# Altium project Relay_Machine_PCB.PrjPcb
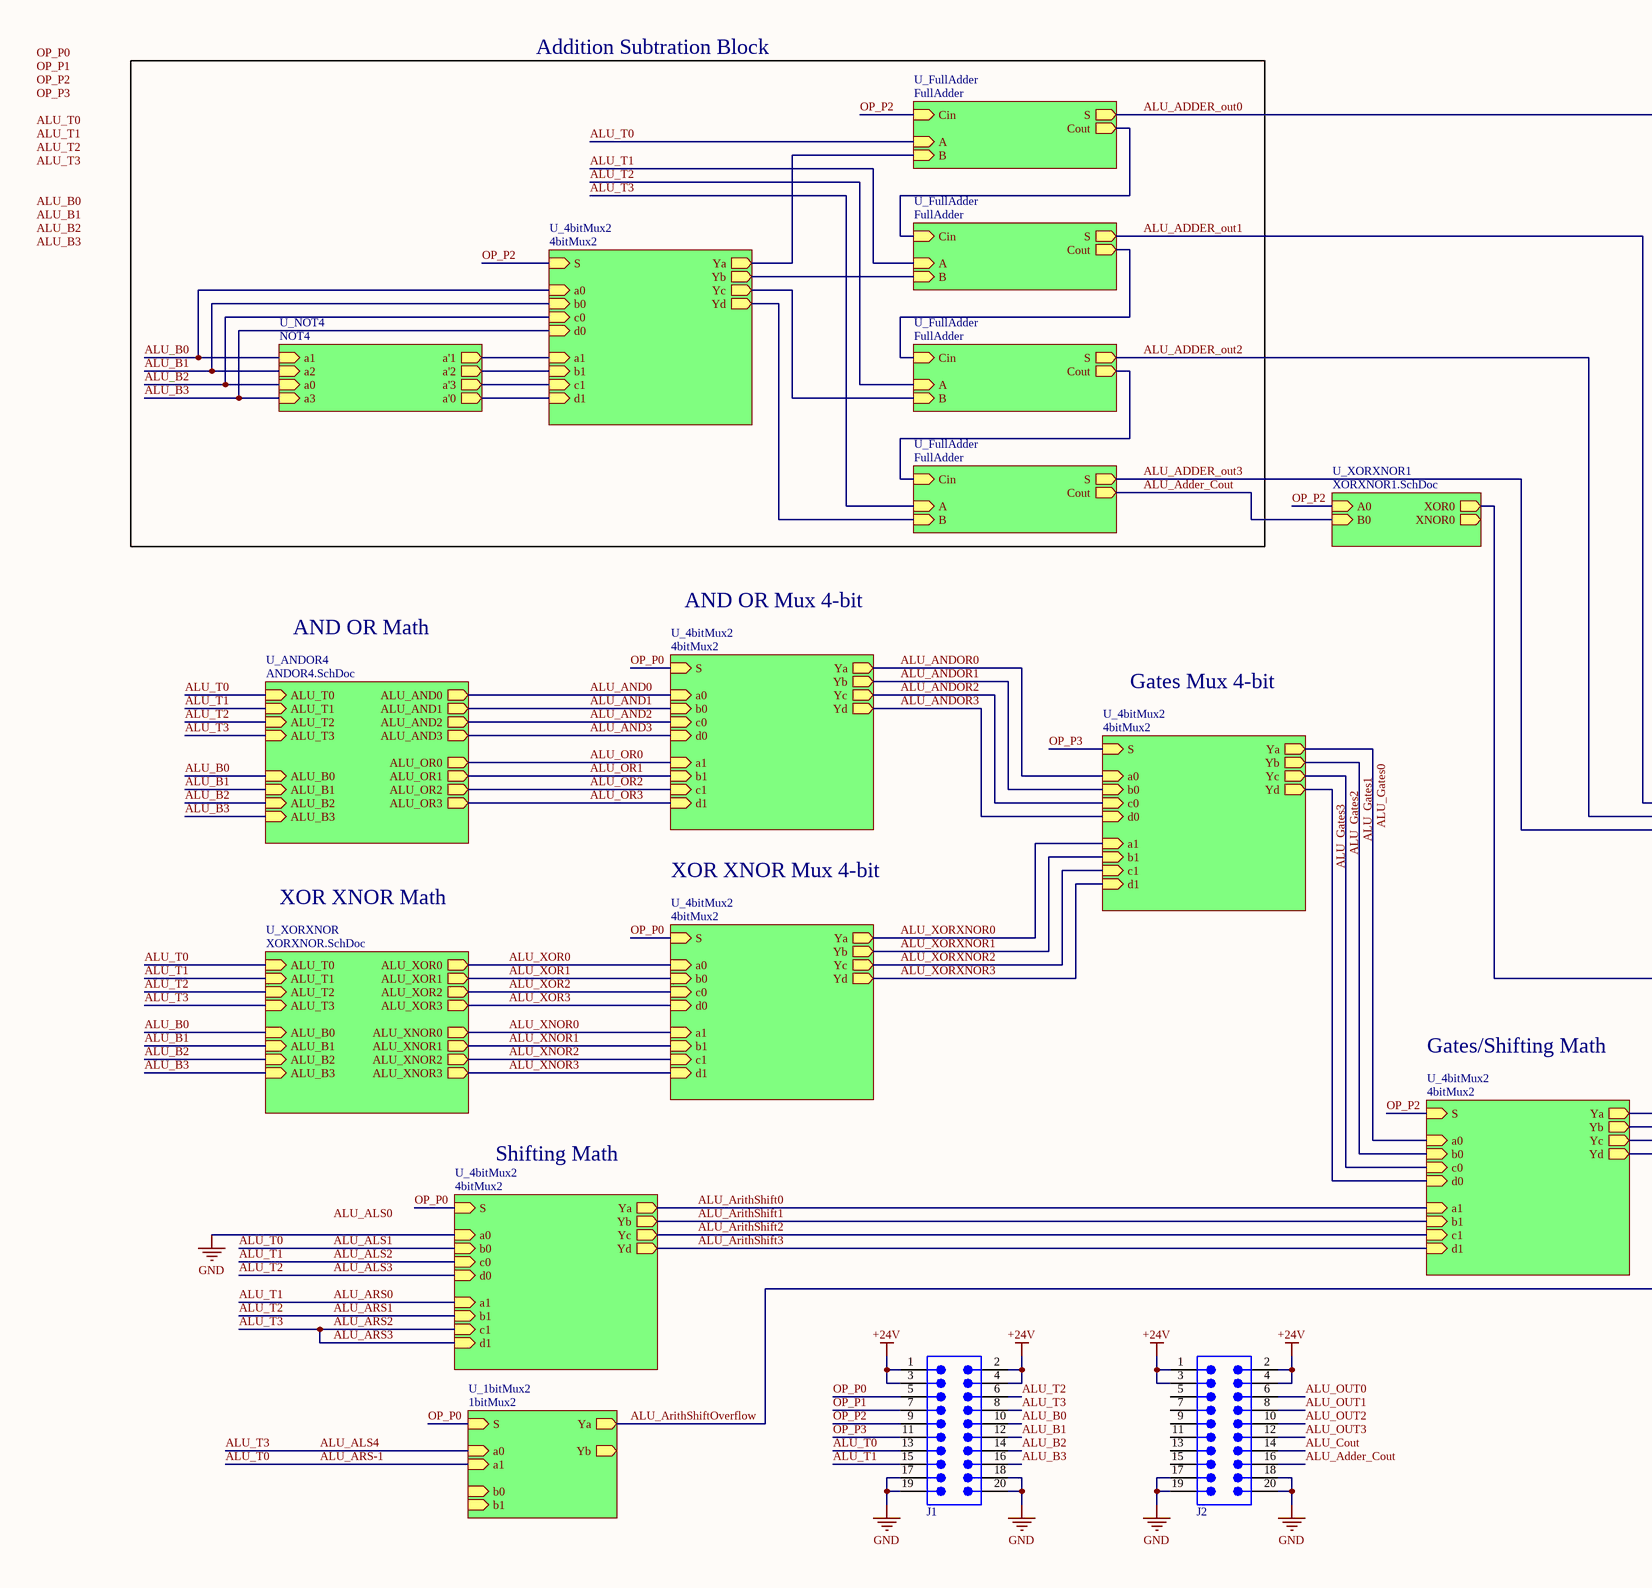
[diagram p0: ALU.SchDoc, left]
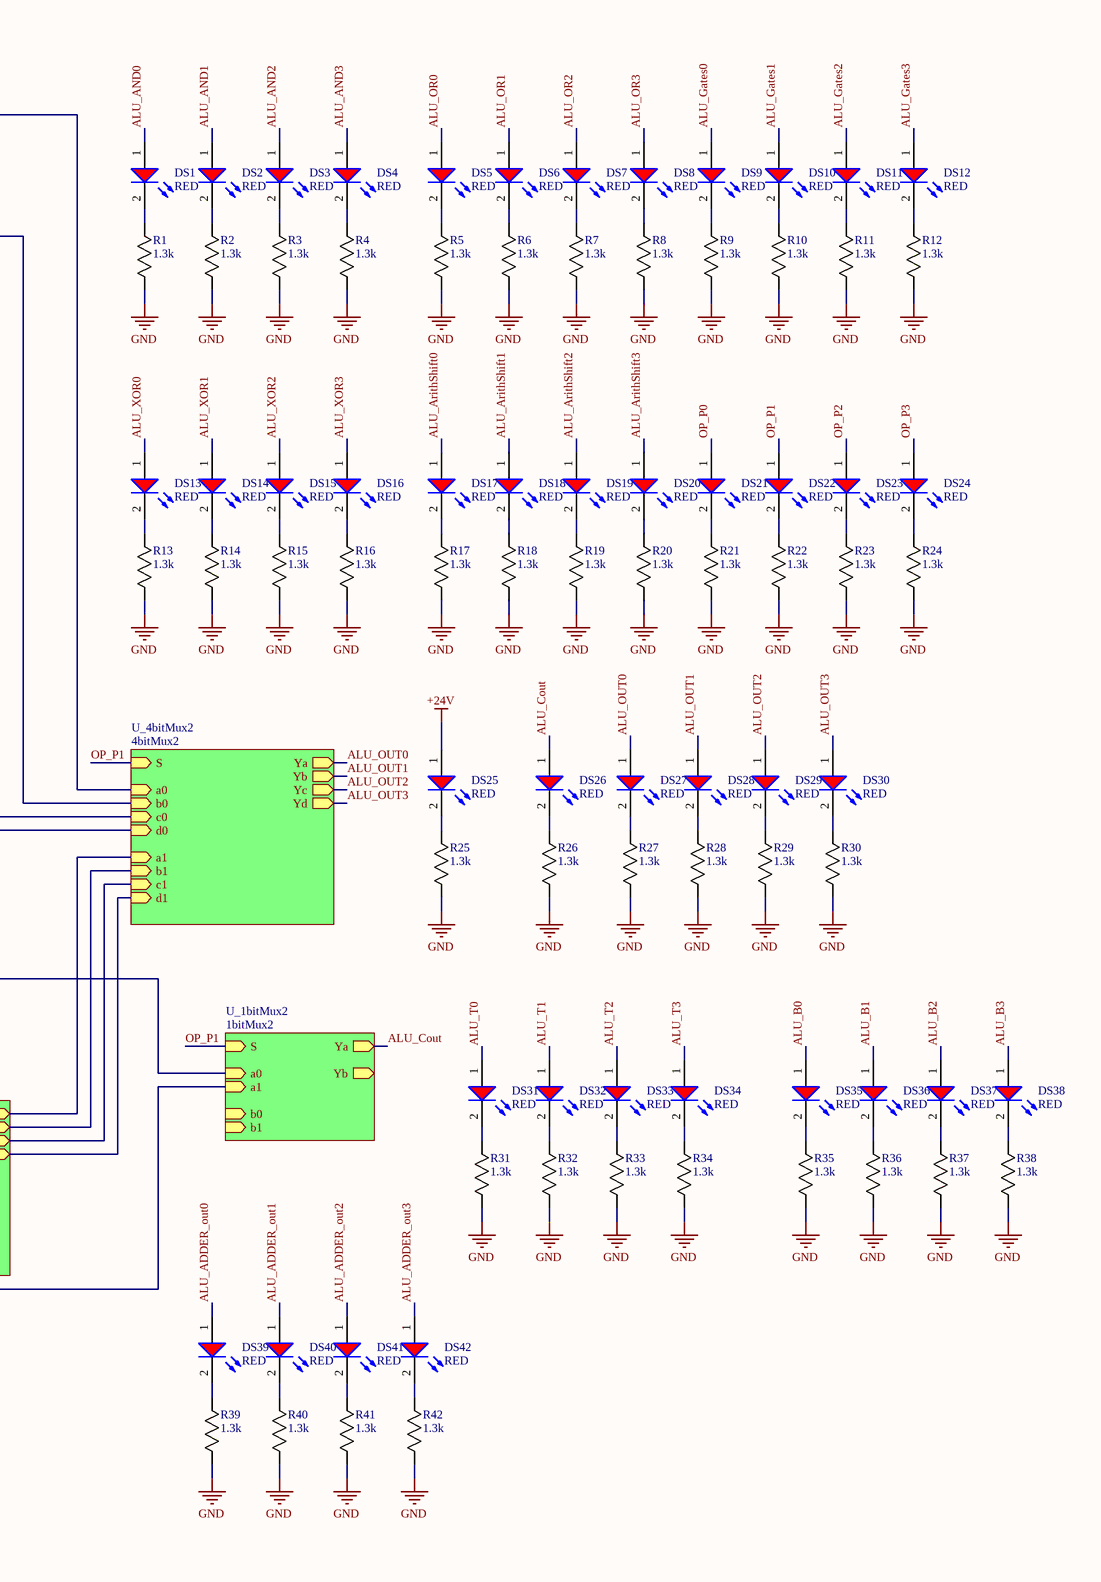
[diagram p1: ALU.SchDoc, right]
4 sheets, 109 parts. Net scope: hierarchical (ports join the sheet entries above them; power ports are global).
Board file: PCB_ALU.PcbDoc
Sheets:
  ALU.SchDoc
    U_ANDOR4 = ANDOR4.SchDoc
    U_XORXNOR = XORXNOR.SchDoc
    U_XORXNOR1 = XORXNOR1.SchDoc

## Sheet ALU.SchDoc
size 533 x 304 mm; SheetNumber: 1; SheetTotal: 8

### Parts
DS1  RED  [LED RED 151051RS11000]
DS2  RED  [LED RED 151051RS11000]
DS3  RED  [LED RED 151051RS11000]
DS4  RED  [LED RED 151051RS11000]
DS5  RED  [LED RED 151051RS11000]
DS6  RED  [LED RED 151051RS11000]
DS7  RED  [LED RED 151051RS11000]
DS8  RED  [LED RED 151051RS11000]
DS9  RED  [LED RED 151051RS11000]
DS10  RED  [LED RED 151051RS11000]
DS11  RED  [LED RED 151051RS11000]
DS12  RED  [LED RED 151051RS11000]
DS13  RED  [LED RED 151051RS11000]
DS14  RED  [LED RED 151051RS11000]
DS15  RED  [LED RED 151051RS11000]
DS16  RED  [LED RED 151051RS11000]
DS17  RED  [LED RED 151051RS11000]
DS18  RED  [LED RED 151051RS11000]
DS19  RED  [LED RED 151051RS11000]
DS20  RED  [LED RED 151051RS11000]
DS21  RED  [LED RED 151051RS11000]
DS22  RED  [LED RED 151051RS11000]
DS23  RED  [LED RED 151051RS11000]
DS24  RED  [LED RED 151051RS11000]
DS25  RED  [LED RED 151051RS11000]
DS26  RED  [LED RED 151051RS11000]
DS27  RED  [LED RED 151051RS11000]
DS28  RED  [LED RED 151051RS11000]
DS29  RED  [LED RED 151051RS11000]
DS30  RED  [LED RED 151051RS11000]
DS31  RED  [LED RED 151051RS11000]
DS32  RED  [LED RED 151051RS11000]
DS33  RED  [LED RED 151051RS11000]
DS34  RED  [LED RED 151051RS11000]
DS35  RED  [LED RED 151051RS11000]
DS36  RED  [LED RED 151051RS11000]
DS37  RED  [LED RED 151051RS11000]
DS38  RED  [LED RED 151051RS11000]
DS39  RED  [LED RED 151051RS11000]
DS40  RED  [LED RED 151051RS11000]
DS41  RED  [LED RED 151051RS11000]
DS42  RED  [LED RED 151051RS11000]
J1  Con 61202021621  [Con 61202021621]  (value not drawn)
J2  Con 61202021621  [Con 61202021621]  (value not drawn)
R1  1.3k  [RES 2512]
R2  1.3k  [RES 2512]
R3  1.3k  [RES 2512]
R4  1.3k  [RES 2512]
R5  1.3k  [RES 2512]
R6  1.3k  [RES 2512]
R7  1.3k  [RES 2512]
R8  1.3k  [RES 2512]
R9  1.3k  [RES 2512]
R10  1.3k  [RES 2512]
R11  1.3k  [RES 2512]
R12  1.3k  [RES 2512]
R13  1.3k  [RES 2512]
R14  1.3k  [RES 2512]
R15  1.3k  [RES 2512]
R16  1.3k  [RES 2512]
R17  1.3k  [RES 2512]
R18  1.3k  [RES 2512]
R19  1.3k  [RES 2512]
R20  1.3k  [RES 2512]
R21  1.3k  [RES 2512]
R22  1.3k  [RES 2512]
R23  1.3k  [RES 2512]
R24  1.3k  [RES 2512]
R25  1.3k  [RES 2512]
R26  1.3k  [RES 2512]
R27  1.3k  [RES 2512]
R28  1.3k  [RES 2512]
R29  1.3k  [RES 2512]
R30  1.3k  [RES 2512]
R31  1.3k  [RES 2512]
R32  1.3k  [RES 2512]
R33  1.3k  [RES 2512]
R34  1.3k  [RES 2512]
R35  1.3k  [RES 2512]
R36  1.3k  [RES 2512]
R37  1.3k  [RES 2512]
R38  1.3k  [RES 2512]
R39  1.3k  [RES 2512]
R40  1.3k  [RES 2512]
R41  1.3k  [RES 2512]
R42  1.3k  [RES 2512]

### Sub-sheets
U_1bitMux2 = 1bitMux2 (file not in this document): S (in), a0 (in), b0 (in), a1 (in), b1 (in), Ya (out), Yb (out)
U_1bitMux2 = 1bitMux2 (file not in this document): S (in), a0 (in), b0 (in), a1 (in), b1 (in), Ya (out), Yb (out)
U_4bitMux2 = 4bitMux2 (file not in this document): S (in), a0 (in), b0 (in), c0 (in), d0 (in), a1 (in), b1 (in), c1 (in), d1 (in), Ya (out), Yb (out), Yc (out), Yd (out)
U_4bitMux2 = 4bitMux2 (file not in this document): S (in), a0 (in), b0 (in), c0 (in), d0 (in), a1 (in), b1 (in), c1 (in), d1 (in), Ya (out), Yb (out), Yc (out), Yd (out)
U_4bitMux2 = 4bitMux2 (file not in this document): S (in), a0 (in), b0 (in), c0 (in), d0 (in), a1 (in), b1 (in), c1 (in), d1 (in), Ya (out), Yb (out), Yc (out), Yd (out)
U_4bitMux2 = 4bitMux2 (file not in this document): S (in), a0 (in), b0 (in), c0 (in), d0 (in), a1 (in), b1 (in), c1 (in), d1 (in), Ya (out), Yb (out), Yc (out), Yd (out)
U_4bitMux2 = 4bitMux2 (file not in this document): S (in), a0 (in), b0 (in), c0 (in), d0 (in), a1 (in), b1 (in), c1 (in), d1 (in), Ya (out), Yb (out), Yc (out), Yd (out)
U_4bitMux2 = 4bitMux2 (file not in this document): S (in), a0 (in), b0 (in), c0 (in), d0 (in), a1 (in), b1 (in), c1 (in), d1 (in), Ya (out), Yb (out), Yc (out), Yd (out)
U_4bitMux2 = 4bitMux2 (file not in this document): S (in), a0 (in), b0 (in), c0 (in), d0 (in), a1 (in), b1 (in), c1 (in), d1 (in), Ya (out), Yb (out), Yc (out), Yd (out)
U_ANDOR4 = ANDOR4.SchDoc: ALU_AND0 (out), ALU_T0 (in), ALU_B0 (in), ALU_OR0 (out), ALU_AND1 (out), ALU_T1 (in), ALU_B1 (in), ALU_OR1 (out), ALU_AND2 (out), ALU_T2 (in), ALU_B2 (in), ALU_OR2 (out), ALU_AND3 (out), ALU_T3 (in), ALU_B3 (in), ALU_OR3 (out)
U_FullAdder = FullAdder (file not in this document): A (in), B (in), Cin (in), S (out), Cout (out)
U_FullAdder = FullAdder (file not in this document): A (in), B (in), Cin (in), S (out), Cout (out)
U_FullAdder = FullAdder (file not in this document): A (in), B (in), Cin (in), S (out), Cout (out)
U_FullAdder = FullAdder (file not in this document): A (in), B (in), Cin (in), S (out), Cout (out)
U_NOT4 = NOT4 (file not in this document): a1 (in), a2 (in), a'1 (out), a'2 (out), a'3 (out), a'0 (out), a0 (in), a3 (in)
U_XORXNOR = XORXNOR.SchDoc: ALU_T0 (in), ALU_B0 (in), ALU_B1 (in), ALU_B2 (in), ALU_B3 (in), ALU_T1 (in), ALU_T2 (in), ALU_T3 (in), ALU_XOR0 (out), ALU_XNOR1 (out), ALU_XNOR3 (out), ALU_XOR1 (out), ALU_XOR3 (out), ALU_XNOR0 (out), ALU_XOR2 (out), ALU_XNOR2 (out)
U_XORXNOR1 = XORXNOR1.SchDoc: B0 (in), A0 (in), XOR0 (out), XNOR0 (out)

### Nets
+24V: DS25.1(A) J1.1 J1.2 J1.3 J1.4 J2.1 J2.2 J2.3 J2.4
GND: J1.17 J1.18 J1.19 J1.20 J2.17 J2.18 J2.19 J2.20 R1.2 R2.2 R3.2 R4.2 R5.2 R6.2 R7.2 R8.2 R9.2 R10.2 R11.2 R12.2 R13.2 R14.2 R15.2 R16.2 R17.2 R18.2 R19.2 R20.2 R21.2 R22.2 R23.2 R24.2 R25.2 R26.2 R27.2 R28.2 R29.2 R30.2 R31.2 R32.2 R33.2 R34.2 R35.2 R36.2 R37.2 R38.2 R39.2 R40.2 R41.2 R42.2 ; sheet U_4bitMux2/a0
ALU_Adder_Cout: J2.16 ; sheet U_FullAdder/Cout, sheet U_XORXNOR1/B0
ALU_ADDER_out0: DS39.1(A) ; sheet U_FullAdder/S, sheet U_4bitMux2/a0
ALU_ADDER_out1: DS40.1(A) ; sheet U_FullAdder/S, sheet U_4bitMux2/b0
ALU_ADDER_out2: DS41.1(A) ; sheet U_FullAdder/S, sheet U_4bitMux2/c0
ALU_ADDER_out3: DS42.1(A) ; sheet U_FullAdder/S, sheet U_4bitMux2/d0
ALU_ALS1: DS31.1(A) J1.13 ; sheet U_ANDOR4/ALU_T0, sheet U_FullAdder/A, sheet U_XORXNOR/ALU_T0, sheet U_1bitMux2/a1, sheet U_4bitMux2/b0  [also labelled ALU_ARS-1, ALU_T0]
ALU_ALS2: DS32.1(A) J1.15 ; sheet U_ANDOR4/ALU_T1, sheet U_FullAdder/A, sheet U_XORXNOR/ALU_T1, sheet U_4bitMux2/c0, sheet U_4bitMux2/a1  [also labelled ALU_ARS0, ALU_T1]
ALU_ALS3: DS33.1(A) J1.6 ; sheet U_ANDOR4/ALU_T2, sheet U_FullAdder/A, sheet U_XORXNOR/ALU_T2, sheet U_4bitMux2/d0, sheet U_4bitMux2/b1  [also labelled ALU_ARS1, ALU_T2]
ALU_ALS4: DS34.1(A) J1.8 ; sheet U_ANDOR4/ALU_T3, sheet U_FullAdder/A, sheet U_XORXNOR/ALU_T3, sheet U_1bitMux2/a0, sheet U_4bitMux2/c1, sheet U_4bitMux2/d1  [also labelled ALU_ARS2, ALU_ARS3, ALU_T3]
ALU_AND0: DS1.1(A) ; sheet U_ANDOR4/ALU_AND0, sheet U_4bitMux2/a0
ALU_AND1: DS2.1(A) ; sheet U_ANDOR4/ALU_AND1, sheet U_4bitMux2/b0
ALU_AND2: DS3.1(A) ; sheet U_ANDOR4/ALU_AND2, sheet U_4bitMux2/c0
ALU_AND3: DS4.1(A) ; sheet U_ANDOR4/ALU_AND3, sheet U_4bitMux2/d0
ALU_ANDOR0: sheet U_4bitMux2/Ya, sheet U_4bitMux2/a0
ALU_ANDOR1: sheet U_4bitMux2/Yb, sheet U_4bitMux2/b0
ALU_ANDOR2: sheet U_4bitMux2/Yc, sheet U_4bitMux2/c0
ALU_ANDOR3: sheet U_4bitMux2/Yd, sheet U_4bitMux2/d0
ALU_ArithShift0: DS17.1(A) ; sheet U_4bitMux2/Ya, sheet U_4bitMux2/a1
ALU_ArithShift1: DS18.1(A) ; sheet U_4bitMux2/Yb, sheet U_4bitMux2/b1
ALU_ArithShift2: DS19.1(A) ; sheet U_4bitMux2/Yc, sheet U_4bitMux2/c1
ALU_ArithShift3: DS20.1(A) ; sheet U_4bitMux2/Yd, sheet U_4bitMux2/d1
ALU_ArithShiftOverflow: sheet U_1bitMux2/Ya, sheet U_1bitMux2/a1
ALU_B0: DS35.1(A) J1.10 ; sheet U_ANDOR4/ALU_B0, sheet U_NOT4/a1, sheet U_4bitMux2/a0, sheet U_XORXNOR/ALU_B0
ALU_B1: DS36.1(A) J1.12 ; sheet U_ANDOR4/ALU_B1, sheet U_NOT4/a2, sheet U_4bitMux2/b0, sheet U_XORXNOR/ALU_B1
ALU_B2: DS37.1(A) J1.14 ; sheet U_ANDOR4/ALU_B2, sheet U_NOT4/a0, sheet U_4bitMux2/c0, sheet U_XORXNOR/ALU_B2
ALU_B3: DS38.1(A) J1.16 ; sheet U_ANDOR4/ALU_B3, sheet U_NOT4/a3, sheet U_4bitMux2/d0, sheet U_XORXNOR/ALU_B3
ALU_Cout: DS26.1(A) J2.14 ; sheet U_1bitMux2/Ya
ALU_Gates0: DS9.1(A) ; sheet U_4bitMux2/Ya, sheet U_4bitMux2/a0
ALU_Gates1: DS10.1(A) ; sheet U_4bitMux2/Yb, sheet U_4bitMux2/b0
ALU_Gates2: DS11.1(A) ; sheet U_4bitMux2/Yc, sheet U_4bitMux2/c0
ALU_Gates3: DS12.1(A) ; sheet U_4bitMux2/Yd, sheet U_4bitMux2/d0
ALU_OR0: DS5.1(A) ; sheet U_ANDOR4/ALU_OR0, sheet U_4bitMux2/a1
ALU_OR1: DS6.1(A) ; sheet U_ANDOR4/ALU_OR1, sheet U_4bitMux2/b1
ALU_OR2: DS7.1(A) ; sheet U_ANDOR4/ALU_OR2, sheet U_4bitMux2/c1
ALU_OR3: DS8.1(A) ; sheet U_ANDOR4/ALU_OR3, sheet U_4bitMux2/d1
ALU_OUT0: DS27.1(A) J2.6 ; sheet U_4bitMux2/Ya
ALU_OUT1: DS28.1(A) J2.8 ; sheet U_4bitMux2/Yb
ALU_OUT2: DS29.1(A) J2.10 ; sheet U_4bitMux2/Yc
ALU_OUT3: DS30.1(A) J2.12 ; sheet U_4bitMux2/Yd
ALU_XNOR0: sheet U_XORXNOR/ALU_XNOR0, sheet U_4bitMux2/a1
ALU_XNOR1: sheet U_XORXNOR/ALU_XNOR1, sheet U_4bitMux2/b1
ALU_XNOR2: sheet U_XORXNOR/ALU_XNOR2, sheet U_4bitMux2/c1
ALU_XNOR3: sheet U_XORXNOR/ALU_XNOR3, sheet U_4bitMux2/d1
ALU_XOR0: DS13.1(A) ; sheet U_XORXNOR/ALU_XOR0, sheet U_4bitMux2/a0
ALU_XOR1: DS14.1(A) ; sheet U_XORXNOR/ALU_XOR1, sheet U_4bitMux2/b0
ALU_XOR2: DS15.1(A) ; sheet U_XORXNOR/ALU_XOR2, sheet U_4bitMux2/c0
ALU_XOR3: DS16.1(A) ; sheet U_XORXNOR/ALU_XOR3, sheet U_4bitMux2/d0
ALU_XORXNOR0: sheet U_4bitMux2/a1, sheet U_4bitMux2/Ya
ALU_XORXNOR1: sheet U_4bitMux2/b1, sheet U_4bitMux2/Yb
ALU_XORXNOR2: sheet U_4bitMux2/c1, sheet U_4bitMux2/Yc
ALU_XORXNOR3: sheet U_4bitMux2/d1, sheet U_4bitMux2/Yd
OP_P0: DS21.1(A) J1.5 ; sheet U_4bitMux2/S, sheet U_4bitMux2/S, sheet U_1bitMux2/S, sheet U_4bitMux2/S
OP_P1: DS22.1(A) J1.7 ; sheet U_4bitMux2/S, sheet U_1bitMux2/S
OP_P2: DS23.1(A) J1.9 ; sheet U_FullAdder/Cin, sheet U_4bitMux2/S, sheet U_4bitMux2/S, sheet U_XORXNOR1/A0
OP_P3: DS24.1(A) J1.11 ; sheet U_4bitMux2/S
NetDS1_2: DS1.2(K) R1.1
NetDS2_2: DS2.2(K) R2.1
NetDS3_2: DS3.2(K) R3.1
NetDS4_2: DS4.2(K) R4.1
NetDS5_2: DS5.2(K) R5.1
NetDS6_2: DS6.2(K) R6.1
NetDS7_2: DS7.2(K) R7.1
NetDS8_2: DS8.2(K) R8.1
NetDS9_2: DS9.2(K) R9.1
NetDS10_2: DS10.2(K) R10.1
NetDS11_2: DS11.2(K) R11.1
NetDS12_2: DS12.2(K) R12.1
NetDS13_2: DS13.2(K) R13.1
NetDS14_2: DS14.2(K) R14.1
NetDS15_2: DS15.2(K) R15.1
NetDS16_2: DS16.2(K) R16.1
NetDS17_2: DS17.2(K) R17.1
NetDS18_2: DS18.2(K) R18.1
NetDS19_2: DS19.2(K) R19.1
NetDS20_2: DS20.2(K) R20.1
NetDS21_2: DS21.2(K) R21.1
NetDS22_2: DS22.2(K) R22.1
NetDS23_2: DS23.2(K) R23.1
NetDS24_2: DS24.2(K) R24.1
NetDS25_2: DS25.2(K) R25.1
NetDS26_2: DS26.2(K) R26.1
NetDS27_2: DS27.2(K) R27.1
NetDS28_2: DS28.2(K) R28.1
NetDS29_2: DS29.2(K) R29.1
NetDS30_2: DS30.2(K) R30.1
NetDS31_2: DS31.2(K) R31.1
NetDS32_2: DS32.2(K) R32.1
NetDS33_2: DS33.2(K) R33.1
NetDS34_2: DS34.2(K) R34.1
NetDS35_2: DS35.2(K) R35.1
NetDS36_2: DS36.2(K) R36.1
NetDS37_2: DS37.2(K) R37.1
NetDS38_2: DS38.2(K) R38.1
NetDS39_2: DS39.2(K) R39.1
NetDS40_2: DS40.2(K) R40.1
NetDS41_2: DS41.2(K) R41.1
NetDS42_2: DS42.2(K) R42.1
NetK9_2: sheet U_1bitMux2/a0, sheet U_XORXNOR1/XOR0
(unnamed): sheet U_FullAdder/B, sheet U_4bitMux2/Ya
(unnamed): sheet U_FullAdder/Cout, sheet U_FullAdder/Cin
(unnamed): sheet U_FullAdder/B, sheet U_4bitMux2/Yb
(unnamed): sheet U_FullAdder/Cout, sheet U_FullAdder/Cin
(unnamed): sheet U_FullAdder/B, sheet U_4bitMux2/Yc
(unnamed): sheet U_FullAdder/Cout, sheet U_FullAdder/Cin
(unnamed): sheet U_FullAdder/B, sheet U_4bitMux2/Yd
(unnamed): sheet U_NOT4/a'1, sheet U_4bitMux2/a1
(unnamed): sheet U_NOT4/a'2, sheet U_4bitMux2/b1
(unnamed): sheet U_NOT4/a'3, sheet U_4bitMux2/c1
(unnamed): sheet U_NOT4/a'0, sheet U_4bitMux2/d1
(unnamed): sheet U_4bitMux2/Ya, sheet U_4bitMux2/a1
(unnamed): sheet U_4bitMux2/Yb, sheet U_4bitMux2/b1
(unnamed): sheet U_4bitMux2/Yc, sheet U_4bitMux2/c1
(unnamed): sheet U_4bitMux2/Yd, sheet U_4bitMux2/d1

Not connected (* = marked no-connect by the designer): J2 5 7 9 11 13 15

### Notes on the sheet
- Addition Subtration Block
- AND OR Mux 4-bit
- AND OR Math
- Gates Mux 4-bit
- XOR XNOR Mux 4-bit
- XOR XNOR Math
- Gates/Shifting Math
- Shifting Math
- Labels drawn without touching a wire or pin: ALU_ALS0, ALU_B0, ALU_B1, ALU_B2, ALU_B3, ALU_T0, ALU_T1, ALU_T2, ALU_T3, OP_P0, OP_P1, OP_P2, OP_P3

### Library data of the parts
DS1-DS42 = LED RED 151051RS11000: WL-TMRC Red Color Diffused 5 mm Round Through Hole LED; Manufacturer: Wurth Elektronik; Dominant Wavelength: 645nm; Forward Current: 100mA; Forward Voltage: 2.1V; Lens Size: 5mm; Lens Style: Circular, Diffused, Round; Luminous Intensity: 30mcd; Max Reverse Voltage (DC): 5V; Peak Wavelength: 650nm; Test Current: 20mA; Viewing Angle: 60°; Wavelength: 630nm; Supplier: DigiKey; Supplier Part Number: 732-5016-ND; Manufacturer Part Number: 151051RS11000; RoHS: Compliant; Category: LEDs; Stock: 19120; Pricing: 1=0.15, 50=0.1396, 100=0.1197, 500=0.105 (USD); Case/Package: Radial; Color: Red; Height: 8.6mm; Length: 5mm; Max Operating Temperature: 85°C; Min Operating Temperature: -40°C; Mounting Technology: Through Hole; Packaging: Bulk; REACH SVHC: Unknown; Width: 5mm; ComponentLink1URL: https://datasheet.octopart.com:443/151051RS11000-Wurth-Elektronik-datasheet-168474692.pdf?src-supplier=Wurth+Elektronik; ComponentLink1Description: https://datasheet.octopart.com:443/151051RS11000-Wurth-Elektronik-datasheet-168474692.pdf?src-supplier=Wurth+Elektronik; ComponentLink2URL: https://datasheet.octopart.com:443/151051RS11000-W%C3%BCrth-Elektronik-datasheet-83005830.pdf?src-supplier=Future+Electronics; ComponentLink2Description: https://datasheet.octopart.com:443/151051RS11000-W%C3%BCrth-Elektronik-datasheet-83005830.pdf?src-supplier=Future+Electronics; ComponentLink3URL: https://datasheet.octopart.com:443/151051RS11000-W%C3%BCrth-Elektronik-datasheet-15983824.pdf?src-supplier=element14+APAC; ComponentLink3Description: https://datasheet.octopart.com:443/151051RS11000-W%C3%BCrth-Elektronik-datasheet-15983824.pdf?src-supplier=element14+APAC
J1 J2 = Con 61202021621: WR-BHD Straight Male, Box Header, Through Hole, 2 Rows, 20 Contacts, 2.54mm Pitch; Manufacturer: Wurth Elektronik; Connector Type: Male Pin; Contact Resistance: 20mΩ; Current Rating: 3A; Insulation: Insulated; Insulation Resistance: 1GΩ; Number of Contacts: 20; Operating Supply Voltage: 250V; Supplier: DigiKey; Supplier Part Number: 732-2096-ND; Manufacturer Part Number: 61202021621; RoHS: Compliant; Category: Headers and Wire Housings; Stock: 12933; Pricing: 1=0.86, 10=0.839, 50=0.7732, 160=0.69213, 320=0.64375 (USD); Color: Black; Contact Gender: Male; Contact Material: Gold; Contact Plating: Gold; Flammability Rating: UL94 V-0; Gender: Male; Height: 9.25mm; Housing Material: PBT; Insulation Material: PBT; Lead Pitch: 2.54mm; Length: 33.06mm; Max Operating Temperature: 105°C; Min Operating Temperature: -40°C; Mounting Technology: Through Hole; Pins: 20; Number of Positions: 20; Number of Rows: 2; Orientation: Vertical; Pitch: 2.54mm; Row Spacing: 2.54mm; Termination: Through Hole; Voltage Rating: 250V; Voltage Rating (DC): 250V; Width: 33.06mm; ComponentLink1URL: https://datasheet.octopart.com:443/61202021621-W%C3%BCrth-Elektronik-datasheet-111087935.pdf?src-supplier=Upverter; ComponentLink1Description: https://datasheet.octopart.com:443/61202021621-W%C3%BCrth-Elektronik-datasheet-111087935.pdf?src-supplier=Upverter; ComponentLink2URL: https://datasheet.octopart.com:443/61202021621-Wurth-Elektronik-datasheet-168480024.pdf?src-supplier=Wurth+Elektronik; ComponentLink2Description: https://datasheet.octopart.com:443/61202021621-Wurth-Elektronik-datasheet-168480024.pdf?src-supplier=Wurth+Elektronik; ComponentLink3URL: https://datasheet.octopart.com:443/61202021621-W%C3%BCrth-Elektronik-datasheet-149523954.pdf?src-supplier=Farnell; ComponentLink3Description: https://datasheet.octopart.com:443/61202021621-W%C3%BCrth-Elektronik-datasheet-149523954.pdf?src-supplier=Farnell; ComponentLink4URL: https://datasheet.octopart.com:443/61202021621-W%C3%BCrth-Elektronik-Midcom-datasheet-10469446.pdf?src-supplier=Farnell; ComponentLink4Description: https://datasheet.octopart.com:443/61202021621-W%C3%BCrth-Elektronik-Midcom-datasheet-10469446.pdf?src-supplier=Farnell; ComponentLink5URL: https://datasheet.octopart.com:443/61202021621-W%C3%BCrth-Elektronik-Midcom-datasheet-5367532.pdf?src-supplier=element14+APAC; ComponentLink5Description: https://datasheet.octopart.com:443/61202021621-W%C3%BCrth-Elektronik-Midcom-datasheet-5367532.pdf?src-supplier=element14+APAC
R1-R42 = RES 1.3k 2512 1W: Res Thick Film 2512 1.3K Ohm 1% 1W ±100ppm/C Pad SMD Automotive T/R RMCF2512FT1K30; Manufacturer: Stackpole Electronics; Value: 1.3kΩ; Temperature Coefficient: 100ppm/°C; Voltage Rating: 500V; Working Voltage: 200V; Supplier: DigiKey; Supplier Part Number: RMCF2512FT1K30CT-ND; Manufacturer Part Number: RMCF2512FT1K30; RoHS: Compliant; Category: Chip SMD Resistors; Stock: 10417; Pricing: 1=0.24, 10=0.126, 25=0.1008, 50=0.0864, 100=0.0751, 250=0.0638, 500=0.05728, 1000=0.0521 (USD); Case/Package: 2512; China RoHS: Non-Compliant; Composition: Thick Film; Contact Plating: Tin; Depth: 3.2mm; Features: Automotive AEC-Q200; Height: 550µm; Length: 6.2992mm; Lifecycle Status: Production; Max Operating Temperature: 155°C; Max Power Dissipation: 1W; Military Standard: Not; Min Operating Temperature: -55°C; Mounting Technology: Surface Mount; Number of Terminals: 2; Number of Terminations: 2; Packaging: Tape & Reel (TR); Power Dissipation: 1W; Power Rating: 1W; Radiation Hardening: No; REACH SVHC: Yes; Schedule B: 8533210045, 8533210045|8533210045|8533210045|8533210045|8533210045; Tolerance: 1%; Width: 3.2mm; ComponentLink1URL: https://datasheet.octopart.com:443/RMCF2512FT1K30-Stackpole-Electronics-datasheet-182148065.pdf?src-supplier=IHS; ComponentLink1Description: https://datasheet.octopart.com:443/RMCF2512FT1K30-Stackpole-Electronics-datasheet-182148065.pdf?src-supplier=IHS; ComponentLink2URL: https://datasheet.octopart.com:443/RMCF2512FT1K30-Stackpole-Electronics-datasheet-28504820.pdf?src-supplier=Future+Electronics; ComponentLink2Description: https://datasheet.octopart.com:443/RMCF2512FT1K30-Stackpole-Electronics-datasheet-28504820.pdf?src-supplier=Future+Electronics; ComponentLink3URL: https://datasheet.octopart.com:443/RMCF2512FT1K30-Stackpole-Electronics-datasheet-141193804.pdf?src-supplier=Master+Electronics; ComponentLink3Description: https://datasheet.octopart.com:443/RMCF2512FT1K30-Stackpole-Electronics-datasheet-141193804.pdf?src-supplier=Master+Electronics; ComponentLink4URL: https://datasheet.octopart.com:443/RMCF2512FT1K30-Stackpole-Electronics-datasheet-189104163.pdf?src-supplier=Master+Electronics; ComponentLink4Description: https://datasheet.octopart.com:443/RMCF2512FT1K30-Stackpole-Electronics-datasheet-189104163.pdf?src-supplier=Master+Electronics; ComponentLink5URL: https://datasheet.octopart.com:443/RMCF2512FT1K30-Stackpole-Electronics-datasheet-116606903.pdf?src-supplier=Master+Electronics; ComponentLink5Description: https://datasheet.octopart.com:443/RMCF2512FT1K30-Stackpole-Electronics-datasheet-116606903.pdf?src-supplier=Master+Electronics; ComponentLink6URL: https://datasheet.octopart.com:443/RMCF2512FT1K30-Stackpole-Electronics-datasheet-62091608.pdf?src-supplier=Stackpole+Electronics; ComponentLink6Description: https://datasheet.octopart.com:443/RMCF2512FT1K30-Stackpole-Electronics-datasheet-62091608.pdf?src-supplier=Stackpole+Electronics; ComponentLink7URL: https://datasheet.octopart.com:443/RMCF2512FT1K30-Stackpole-Electronics-datasheet-12534581.pdf?src-supplier=Stackpole+Electronics; ComponentLink7Description: https://datasheet.octopart.com:443/RMCF2512FT1K30-Stackpole-Electronics-datasheet-12534581.pdf?src-supplier=Stackpole+Electronics; ComponentLink8URL: https://datasheet.octopart.com:443/RMCF2512FT1K30-Stackpole-Electronics-datasheet-10788263.pdf?src-supplier=Stackpole+Electronics; ComponentLink8Description: https://datasheet.octopart.com:443/RMCF2512FT1K30-Stackpole-Electronics-datasheet-10788263.pdf?src-supplier=Stackpole+Electronics; ComponentLink9URL: http://sigma.octopart.com:80/15940719/materials_sheet/Stackpole-Electronics-RMCF2512FT1K30.pdf?src-supplier=Compliance+Statements; ComponentLink9Description: http://sigma.octopart.com:80/15940719/materials_sheet/Stackpole-Electronics-RMCF2512FT1K30.pdf?src-supplier=Compliance+Statements; ComponentLink10URL: http://sigma.octopart.com:80/141158212/rohs_statement/Stackpole-Electronics-RMCF2512FT1K30.pdf?src-supplier=Compliance+Statements; ComponentLink10Description: http://sigma.octopart.com:80/141158212/rohs_statement/Stackpole-Electronics-RMCF2512FT1K30.pdf?src-supplier=Compliance+Statements; ComponentLink11URL: http://sigma.octopart.com:80/141158211/reach_statement/Stackpole-Electronics-RMCF2512FT1K30.pdf?src-supplier=Compliance+Statements; ComponentLink11Description: http://sigma.octopart.com:80/141158211/reach_statement/Stackpole-Electronics-RMCF2512FT1K30.pdf?src-supplier=Compliance+Statements

## Sheet ANDOR4.SchDoc
size A; SheetNumber: 2; SheetTotal: 8
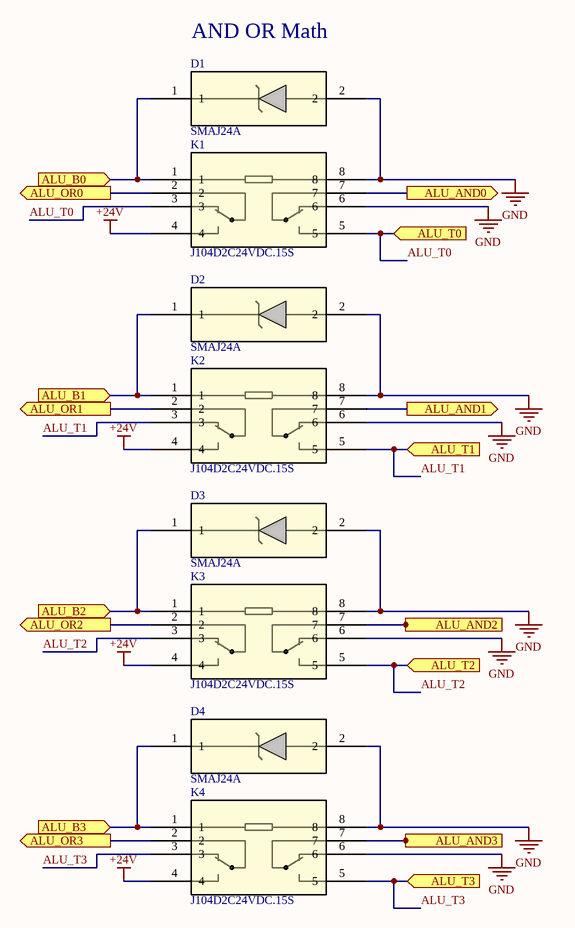
[diagram p2: ANDOR4.SchDoc]

### Parts
D1  SMAJ24A  [DI SMAJ24A]
D2  SMAJ24A  [DI SMAJ24A]
D3  SMAJ24A  [DI SMAJ24A]
D4  SMAJ24A  [DI SMAJ24A]
K1  J104D2C24VDC.15S  [Relay J104D2C24VDC.15S]
K2  J104D2C24VDC.15S  [Relay J104D2C24VDC.15S]
K3  J104D2C24VDC.15S  [Relay J104D2C24VDC.15S]
K4  J104D2C24VDC.15S  [Relay J104D2C24VDC.15S]

### Ports
ALU_AND0 (out, see ALU[2B]), ALU_AND1 (out, see ALU[2B]), ALU_AND2 (out, see ALU[2B]), ALU_AND3 (out, see ALU[2B]), ALU_B0 (in, see ALU[1B], XORXNOR[1B]), ALU_B1 (in, see ALU[1C], XORXNOR[1C]), ALU_B2 (in, see ALU[1C], XORXNOR[3B]), ALU_B3 (in, see ALU[1C], XORXNOR[3C]), ALU_OR0 (out, see ALU[2B]), ALU_OR1 (out, see ALU[2B]), ALU_OR2 (out, see ALU[2C]), ALU_OR3 (out, see ALU[2C]), ALU_T0 (in, see ALU[1B], XORXNOR[2B]), ALU_T1 (in, see ALU[1B], XORXNOR[2C]), ALU_T2 (in, see ALU[1B], XORXNOR[4B]), ALU_T3 (in, see ALU[1B], XORXNOR[4C])

### Nets
+24V: K1.4 K2.4 K3.4 K4.4
GND: D1.2 D2.2 D3.2 D4.2 K1.6 K1.8 K2.6 K2.8 K3.6 K3.8 K4.6 K4.8
ALU_AND0: K1.7 ; port ALU_AND0
ALU_AND1: K2.7 ; port ALU_AND1
ALU_AND2: K3.7 ; port ALU_AND2
ALU_AND3: K4.7 ; port ALU_AND3
ALU_B0: D1.1 K1.1 ; port ALU_B0
ALU_B1: D2.1 K2.1 ; port ALU_B1
ALU_B2: D3.1 K3.1 ; port ALU_B2
ALU_B3: D4.1 K4.1 ; port ALU_B3
ALU_OR0: K1.2 ; port ALU_OR0
ALU_OR1: K2.2 ; port ALU_OR1
ALU_OR2: K3.2 ; port ALU_OR2
ALU_OR3: K4.2 ; port ALU_OR3
ALU_T0: K1.3 K1.5 ; port ALU_T0  [project net ALU_ALS1]
ALU_T1: K2.3 K2.5 ; port ALU_T1  [project net ALU_ALS2]
ALU_T2: K3.3 K3.5 ; port ALU_T2  [project net ALU_ALS3]
ALU_T3: K4.3 K4.5 ; port ALU_T3  [project net ALU_ALS4]

### Notes on the sheet
- AND OR Math

### Library data of the parts
D1-D4 = DI SMAJ24A: SMAJ Series 400 W 24 V Uni-Directional Surface Mount TVS Diode - DO-214AC; Manufacturer: Littelfuse; Breakdown Voltage: 28.1V; Value: 650pF; Clamping Voltage: 38.9V; Direction: Unidirectional; Element Configuration: Single; Forward Voltage: 3.5V; Leakage Current: 1µA; Max Breakdown Voltage: 29.5V; Max Junction Temperature (Tj): 150°C; Max Output current: 10.3A; Max Power Dissipation: 3.3W; Min Breakdown Voltage: 26.7V; Number of Channels: 1; Operating Supply Voltage: 24V; Peak Pulse Power: 400W; Power Line Protection: No; Test Current: 1mA; Supplier: DigiKey; Supplier Part Number: SMAJ24ALFCT-ND; Manufacturer Part Number: SMAJ24A; RoHS: Compliant; Category: TVS Diodes; Stock: 97583; Pricing: 1=0.21, 10=0.113, 100=0.074, 500=0.072, 1000=0.071 (USD); Case/Package: SMA; China RoHS: Non-Compliant; Composition: Zener; Height: 2.29mm; Lead Free: Lead Free; Length: 4.5mm; Lifecycle Status: Production; Max Operating Temperature: 150°C; Max Reverse Leakage Current: 1µA; Max Surge Current: 10.3A; Min Operating Temperature: -65°C; Mounting Technology: Surface Mount; Number of Elements: 1; Pins: 2; Number of Terminals: 2; Number of Unidirectional Channels: 1; Packaging: Tape & Reel; Peak Pulse Current: 10.3A; Peak Reverse Current: 1µA; Polarity: Unidirectional; Power Dissipation: 400W; Power Rating: 400W; Radiation Hardening: No; REACH SVHC: No; Reverse Breakdown Voltage: 26.7V; Reverse Standoff Voltage: 24V; Reverse Voltage: 24V; Schedule B: 8541100080, 8541100080|8541100080|8541100080|8541100080|8541100080; Termination: SMD/SMT; Voltage Rating (DC): 24V; Width: 2.79mm; ComponentLink1URL: https://datasheet.octopart.com:443/SMAJ24A-Littelfuse-datasheet-150463581.pdf?src-supplier=Farnell; ComponentLink1Description: https://datasheet.octopart.com:443/SMAJ24A-Littelfuse-datasheet-150463581.pdf?src-supplier=Farnell; ComponentLink2URL: https://datasheet.octopart.com:443/SMAJ24A-Littelfuse-datasheet-63710798.pdf?src-supplier=element14+APAC; ComponentLink2Description: https://datasheet.octopart.com:443/SMAJ24A-Littelfuse-datasheet-63710798.pdf?src-supplier=element14+APAC; ComponentLink3URL: https://datasheet.octopart.com:443/SMAJ24A-Littelfuse-datasheet-11547152.pdf?src-supplier=element14+APAC; ComponentLink3Description: https://datasheet.octopart.com:443/SMAJ24A-Littelfuse-datasheet-11547152.pdf?src-supplier=element14+APAC; ComponentLink4URL: https://datasheet.octopart.com:443/SMAJ24A-Littelfuse-datasheet-5393952.pdf?src-supplier=element14+APAC; ComponentLink4Description: https://datasheet.octopart.com:443/SMAJ24A-Littelfuse-datasheet-5393952.pdf?src-supplier=element14+APAC; ComponentLink5URL: https://datasheet.octopart.com:443/SMAJ24A-Littelfuse-datasheet-511791.pdf?src-supplier=element14+APAC; ComponentLink5Description: https://datasheet.octopart.com:443/SMAJ24A-Littelfuse-datasheet-511791.pdf?src-supplier=element14+APAC; ComponentLink6URL: https://datasheet.octopart.com:443/SMAJ24A-Littelfuse-datasheet-164649624.pdf?src-supplier=JRH+Electronics; ComponentLink6Description: https://datasheet.octopart.com:443/SMAJ24A-Littelfuse-datasheet-164649624.pdf?src-supplier=JRH+Electronics; ComponentLink7URL: https://datasheet.octopart.com:443/SMAJ24A-Littelfuse-datasheet-38878911.pdf?src-supplier=RS+(Formerly+Allied+Electronics); ComponentLink7Description: https://datasheet.octopart.com:443/SMAJ24A-Littelfuse-datasheet-38878911.pdf?src-supplier=RS+(Formerly+Allied+Electronics); ComponentLink8URL: https://datasheet.octopart.com:443/SMAJ24A-Littelfuse-datasheet-17901671.pdf?src-supplier=Future+Electronics; ComponentLink8Description: https://datasheet.octopart.com:443/SMAJ24A-Littelfuse-datasheet-17901671.pdf?src-supplier=Future+Electronics; ComponentLink9URL: https://datasheet.octopart.com:443/SMAJ24A-Littelfuse-datasheet-1053.pdf?src-supplier=DigiKey; ComponentLink9Description: https://datasheet.octopart.com:443/SMAJ24A-Littelfuse-datasheet-1053.pdf?src-supplier=DigiKey
K1-K4 = Relay J104D2C24VDC.15S: Relay Ul Gen Purp DPDT 2C 24VDC; Manufacturer: CIT Relay & Switch; Coil Current: 6mA; Coil Power: 150mW; Coil Resistance: 3.84kΩ; Coil Voltage (DC): 18V; Contact Current Rating: 2A; Contact Resistance: 50mΩ; Contact Voltage Rating (AC): 250V; Electrical Life: 100kcycles; Insulation Resistance: 100MΩ; Max Voltage Rating (DC): 100V; Release Time: 4ms; Response Time: 6ms; Supplier: DigiKey; Supplier Part Number: 2449-J104D2C24VDC.15S-ND; Manufacturer Part Number: J104D2C24VDC.15S; Category: Signal Relays; Stock: 5620; Pricing: 1=1.26, 20=1.082, 40=1.045, 60=1.02383, 100=0.998, 260=0.95115, 500=0.92036, 1000=0.88878, 5000=0.8195 (USD); Contact Plating: Gold; Height: 11.42mm; Length: 20.37mm; Max Current Rating: 2A; Max Operating Temperature: 85°C; Min Operating Temperature: -40°C; Number of Terminals: 8; Throw Configuration: DPDT

## Sheet XORXNOR.SchDoc
size 381 x 241 mm; SheetNumber: 3; SheetTotal: 7
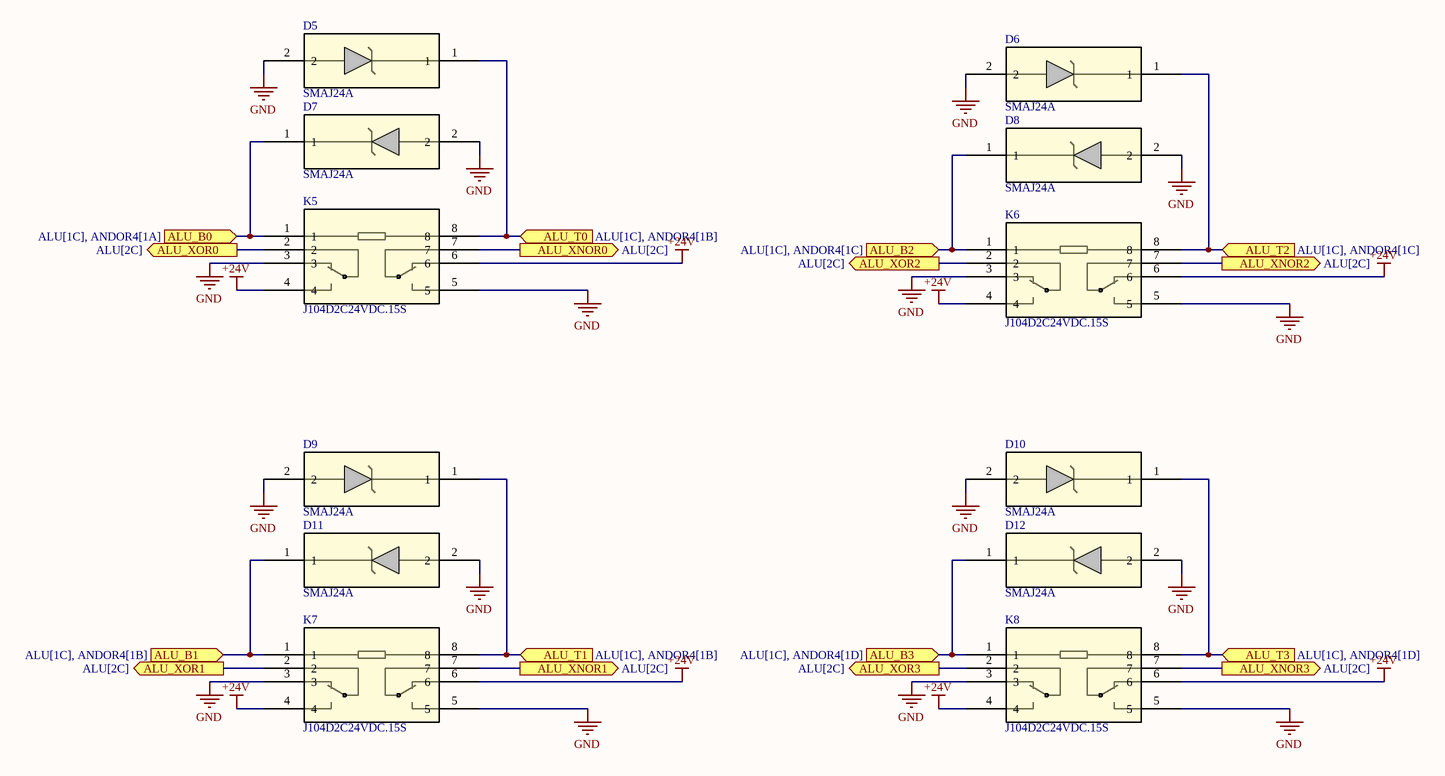
[diagram p3: XORXNOR.SchDoc]

### Parts
D5  SMAJ24A  [DI SMAJ24A]
D6  SMAJ24A  [DI SMAJ24A]
D7  SMAJ24A  [DI SMAJ24A]
D8  SMAJ24A  [DI SMAJ24A]
D9  SMAJ24A  [DI SMAJ24A]
D10  SMAJ24A  [DI SMAJ24A]
D11  SMAJ24A  [DI SMAJ24A]
D12  SMAJ24A  [DI SMAJ24A]
K5  J104D2C24VDC.15S  [Relay J104D2C24VDC.15S]
K6  J104D2C24VDC.15S  [Relay J104D2C24VDC.15S]
K7  J104D2C24VDC.15S  [Relay J104D2C24VDC.15S]
K8  J104D2C24VDC.15S  [Relay J104D2C24VDC.15S]

### Ports
ALU_B0 (in, see ALU[1C], ANDOR4[1A]), ALU_B1 (in, see ALU[1C], ANDOR4[1B]), ALU_B2 (in, see ALU[1C], ANDOR4[1C]), ALU_B3 (in, see ALU[1C], ANDOR4[1D]), ALU_T0 (in, see ALU[1C], ANDOR4[1B]), ALU_T1 (in, see ALU[1C], ANDOR4[1B]), ALU_T2 (in, see ALU[1C], ANDOR4[1C]), ALU_T3 (in, see ALU[1C], ANDOR4[1D]), ALU_XNOR0 (out, see ALU[2C]), ALU_XNOR1 (out, see ALU[2C]), ALU_XNOR2 (out, see ALU[2C]), ALU_XNOR3 (out, see ALU[2C]), ALU_XOR0 (out, see ALU[2C]), ALU_XOR1 (out, see ALU[2C]), ALU_XOR2 (out, see ALU[2C]), ALU_XOR3 (out, see ALU[2C])

### Nets
+24V: K5.4 K5.6 K6.4 K6.6 K7.4 K7.6 K8.4 K8.6
GND: D5.2 D6.2 D7.2 D8.2 D9.2 D10.2 D11.2 D12.2 K5.3 K5.5 K6.3 K6.5 K7.3 K7.5 K8.3 K8.5
ALU_ALS1: D5.1 K5.8 ; port ALU_T0
ALU_ALS2: D9.1 K7.8 ; port ALU_T1
ALU_ALS3: D6.1 K6.8 ; port ALU_T2
ALU_ALS4: D10.1 K8.8 ; port ALU_T3
ALU_B0: D7.1 K5.1 ; port ALU_B0
ALU_B1: D11.1 K7.1 ; port ALU_B1
ALU_B2: D8.1 K6.1 ; port ALU_B2
ALU_B3: D12.1 K8.1 ; port ALU_B3
ALU_XNOR0: K5.7 ; port ALU_XNOR0
ALU_XNOR1: K7.7 ; port ALU_XNOR1
ALU_XNOR2: K6.7 ; port ALU_XNOR2
ALU_XNOR3: K8.7 ; port ALU_XNOR3
ALU_XOR0: K5.2 ; port ALU_XOR0
ALU_XOR1: K7.2 ; port ALU_XOR1
ALU_XOR2: K6.2 ; port ALU_XOR2
ALU_XOR3: K8.2 ; port ALU_XOR3

### Library data of the parts
D5-D12 = DI SMAJ24A: as D1 on sheet ANDOR4; Supplier: DigiKey; Supplier Part Number: SMAJ24ALFCT-ND; Manufacturer Part Number: SMAJ24A; RoHS: Compliant; Category: TVS Diodes; Stock: 97583; Pricing: 1=0.21, 10=0.113, 100=0.074, 500=0.072, 1000=0.071 (USD); Case/Package: SMA; China RoHS: Non-Compliant; Composition: Zener; Height: 2.29mm; Lead Free: Lead Free; Length: 4.5mm; Lifecycle Status: Production; Max Operating Temperature: 150°C; Max Reverse Leakage Current: 1µA; Max Surge Current: 10.3A; Min Operating Temperature: -65°C; Mounting Technology: Surface Mount; Number of Elements: 1; Pins: 2; Number of Terminals: 2; Number of Unidirectional Channels: 1; Packaging: Tape & Reel; Peak Pulse Current: 10.3A; Peak Reverse Current: 1µA; Polarity: Unidirectional; Power Dissipation: 400W; Power Rating: 400W; Radiation Hardening: No; REACH SVHC: No; Reverse Breakdown Voltage: 26.7V; Reverse Standoff Voltage: 24V; Reverse Voltage: 24V; Schedule B: 8541100080, 8541100080|8541100080|8541100080|8541100080|8541100080; Termination: SMD/SMT; Voltage Rating (DC): 24V; Width: 2.79mm; ComponentLink1URL: https://datasheet.octopart.com:443/SMAJ24A-Littelfuse-datasheet-150463581.pdf?src-supplier=Farnell; ComponentLink1Description: https://datasheet.octopart.com:443/SMAJ24A-Littelfuse-datasheet-150463581.pdf?src-supplier=Farnell; ComponentLink2URL: https://datasheet.octopart.com:443/SMAJ24A-Littelfuse-datasheet-63710798.pdf?src-supplier=element14+APAC; ComponentLink2Description: https://datasheet.octopart.com:443/SMAJ24A-Littelfuse-datasheet-63710798.pdf?src-supplier=element14+APAC; ComponentLink3URL: https://datasheet.octopart.com:443/SMAJ24A-Littelfuse-datasheet-11547152.pdf?src-supplier=element14+APAC; ComponentLink3Description: https://datasheet.octopart.com:443/SMAJ24A-Littelfuse-datasheet-11547152.pdf?src-supplier=element14+APAC; ComponentLink4URL: https://datasheet.octopart.com:443/SMAJ24A-Littelfuse-datasheet-5393952.pdf?src-supplier=element14+APAC; ComponentLink4Description: https://datasheet.octopart.com:443/SMAJ24A-Littelfuse-datasheet-5393952.pdf?src-supplier=element14+APAC; ComponentLink5URL: https://datasheet.octopart.com:443/SMAJ24A-Littelfuse-datasheet-511791.pdf?src-supplier=element14+APAC; ComponentLink5Description: https://datasheet.octopart.com:443/SMAJ24A-Littelfuse-datasheet-511791.pdf?src-supplier=element14+APAC; ComponentLink6URL: https://datasheet.octopart.com:443/SMAJ24A-Littelfuse-datasheet-164649624.pdf?src-supplier=JRH+Electronics; ComponentLink6Description: https://datasheet.octopart.com:443/SMAJ24A-Littelfuse-datasheet-164649624.pdf?src-supplier=JRH+Electronics; ComponentLink7URL: https://datasheet.octopart.com:443/SMAJ24A-Littelfuse-datasheet-38878911.pdf?src-supplier=RS+(Formerly+Allied+Electronics); ComponentLink7Description: https://datasheet.octopart.com:443/SMAJ24A-Littelfuse-datasheet-38878911.pdf?src-supplier=RS+(Formerly+Allied+Electronics); ComponentLink8URL: https://datasheet.octopart.com:443/SMAJ24A-Littelfuse-datasheet-17901671.pdf?src-supplier=Future+Electronics; ComponentLink8Description: https://datasheet.octopart.com:443/SMAJ24A-Littelfuse-datasheet-17901671.pdf?src-supplier=Future+Electronics; ComponentLink9URL: https://datasheet.octopart.com:443/SMAJ24A-Littelfuse-datasheet-1053.pdf?src-supplier=DigiKey; ComponentLink9Description: https://datasheet.octopart.com:443/SMAJ24A-Littelfuse-datasheet-1053.pdf?src-supplier=DigiKey
K5-K8 = Relay J104D2C24VDC.15S: as K1 on sheet ANDOR4; Supplier: DigiKey; Supplier Part Number: 2449-J104D2C24VDC.15S-ND; Manufacturer Part Number: J104D2C24VDC.15S; Category: Signal Relays; Stock: 5620; Pricing: 1=1.26, 20=1.082, 40=1.045, 60=1.02383, 100=0.998, 260=0.95115, 500=0.92036, 1000=0.88878, 5000=0.8195 (USD); Contact Plating: Gold; Height: 11.42mm; Length: 20.37mm; Max Current Rating: 2A; Max Operating Temperature: 85°C; Min Operating Temperature: -40°C; Number of Terminals: 8; Throw Configuration: DPDT

## Sheet XORXNOR1.SchDoc
size A; SheetNumber: 4; SheetTotal: 8
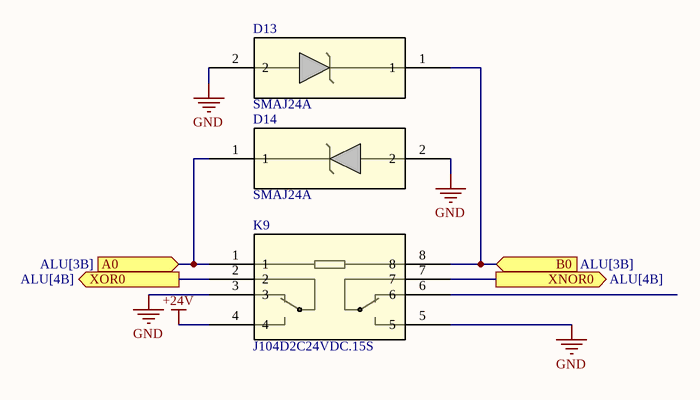
[diagram p4: XORXNOR1.SchDoc]

### Parts
D13  SMAJ24A  [DI SMAJ24A]
D14  SMAJ24A  [DI SMAJ24A]
K9  J104D2C24VDC.15S  [Relay J104D2C24VDC.15S]

### Ports
A0 (in, see ALU[3B]), B0 (in, see ALU[3B]), XNOR0 (out, see ALU[4B]), XOR0 (out, see ALU[4B])

### Nets
+24V: K9.4
GND: D13.2 D14.2 K9.3 K9.5
ALU_Adder_Cout: D13.1 K9.8 ; port B0
OP_P2: D14.1 K9.1 ; port A0
NetK9_2: K9.2 ; port XOR0
NetK9_7: K9.7 ; port XNOR0

Not connected (* = marked no-connect by the designer): K9 6

### Library data of the parts
D13 D14 = DI SMAJ24A: as D1 on sheet ANDOR4; Supplier: DigiKey; Supplier Part Number: SMAJ24ALFCT-ND; Manufacturer Part Number: SMAJ24A; RoHS: Compliant; Category: TVS Diodes; Stock: 97583; Pricing: 1=0.21, 10=0.113, 100=0.074, 500=0.072, 1000=0.071 (USD); Case/Package: SMA; China RoHS: Non-Compliant; Composition: Zener; Height: 2.29mm; Lead Free: Lead Free; Length: 4.5mm; Lifecycle Status: Production; Max Operating Temperature: 150°C; Max Reverse Leakage Current: 1µA; Max Surge Current: 10.3A; Min Operating Temperature: -65°C; Mounting Technology: Surface Mount; Number of Elements: 1; Pins: 2; Number of Terminals: 2; Number of Unidirectional Channels: 1; Packaging: Tape & Reel; Peak Pulse Current: 10.3A; Peak Reverse Current: 1µA; Polarity: Unidirectional; Power Dissipation: 400W; Power Rating: 400W; Radiation Hardening: No; REACH SVHC: No; Reverse Breakdown Voltage: 26.7V; Reverse Standoff Voltage: 24V; Reverse Voltage: 24V; Schedule B: 8541100080, 8541100080|8541100080|8541100080|8541100080|8541100080; Termination: SMD/SMT; Voltage Rating (DC): 24V; Width: 2.79mm; ComponentLink1URL: https://datasheet.octopart.com:443/SMAJ24A-Littelfuse-datasheet-150463581.pdf?src-supplier=Farnell; ComponentLink1Description: https://datasheet.octopart.com:443/SMAJ24A-Littelfuse-datasheet-150463581.pdf?src-supplier=Farnell; ComponentLink2URL: https://datasheet.octopart.com:443/SMAJ24A-Littelfuse-datasheet-63710798.pdf?src-supplier=element14+APAC; ComponentLink2Description: https://datasheet.octopart.com:443/SMAJ24A-Littelfuse-datasheet-63710798.pdf?src-supplier=element14+APAC; ComponentLink3URL: https://datasheet.octopart.com:443/SMAJ24A-Littelfuse-datasheet-11547152.pdf?src-supplier=element14+APAC; ComponentLink3Description: https://datasheet.octopart.com:443/SMAJ24A-Littelfuse-datasheet-11547152.pdf?src-supplier=element14+APAC; ComponentLink4URL: https://datasheet.octopart.com:443/SMAJ24A-Littelfuse-datasheet-5393952.pdf?src-supplier=element14+APAC; ComponentLink4Description: https://datasheet.octopart.com:443/SMAJ24A-Littelfuse-datasheet-5393952.pdf?src-supplier=element14+APAC; ComponentLink5URL: https://datasheet.octopart.com:443/SMAJ24A-Littelfuse-datasheet-511791.pdf?src-supplier=element14+APAC; ComponentLink5Description: https://datasheet.octopart.com:443/SMAJ24A-Littelfuse-datasheet-511791.pdf?src-supplier=element14+APAC; ComponentLink6URL: https://datasheet.octopart.com:443/SMAJ24A-Littelfuse-datasheet-164649624.pdf?src-supplier=JRH+Electronics; ComponentLink6Description: https://datasheet.octopart.com:443/SMAJ24A-Littelfuse-datasheet-164649624.pdf?src-supplier=JRH+Electronics; ComponentLink7URL: https://datasheet.octopart.com:443/SMAJ24A-Littelfuse-datasheet-38878911.pdf?src-supplier=RS+(Formerly+Allied+Electronics); ComponentLink7Description: https://datasheet.octopart.com:443/SMAJ24A-Littelfuse-datasheet-38878911.pdf?src-supplier=RS+(Formerly+Allied+Electronics); ComponentLink8URL: https://datasheet.octopart.com:443/SMAJ24A-Littelfuse-datasheet-17901671.pdf?src-supplier=Future+Electronics; ComponentLink8Description: https://datasheet.octopart.com:443/SMAJ24A-Littelfuse-datasheet-17901671.pdf?src-supplier=Future+Electronics; ComponentLink9URL: https://datasheet.octopart.com:443/SMAJ24A-Littelfuse-datasheet-1053.pdf?src-supplier=DigiKey; ComponentLink9Description: https://datasheet.octopart.com:443/SMAJ24A-Littelfuse-datasheet-1053.pdf?src-supplier=DigiKey
K9 = Relay J104D2C24VDC.15S: as K1 on sheet ANDOR4; Supplier: DigiKey; Supplier Part Number: 2449-J104D2C24VDC.15S-ND; Manufacturer Part Number: J104D2C24VDC.15S; Category: Signal Relays; Stock: 5620; Pricing: 1=1.26, 20=1.082, 40=1.045, 60=1.02383, 100=0.998, 260=0.95115, 500=0.92036, 1000=0.88878, 5000=0.8195 (USD); Contact Plating: Gold; Height: 11.42mm; Length: 20.37mm; Max Current Rating: 2A; Max Operating Temperature: 85°C; Min Operating Temperature: -40°C; Number of Terminals: 8; Throw Configuration: DPDT

## Nets that join several sheets
+24V: ALU (9 pins), ANDOR4 (K1.4 K2.4 K3.4 K4.4), XORXNOR (8 pins), XORXNOR1 (K9.4)
GND: ALU (50 pins), ANDOR4 (12 pins), XORXNOR (16 pins), XORXNOR1 (D13.2 D14.2 K9.3 K9.5)
ALU_Adder_Cout: ALU (J2.16), XORXNOR1 (D13.1 K9.8)
ALU_ALS1: ALU (DS31.1 J1.13), ANDOR4 (K1.3 K1.5), XORXNOR (D5.1 K5.8)
ALU_ALS2: ALU (DS32.1 J1.15), ANDOR4 (K2.3 K2.5), XORXNOR (D9.1 K7.8)
ALU_ALS3: ALU (DS33.1 J1.6), ANDOR4 (K3.3 K3.5), XORXNOR (D6.1 K6.8)
ALU_ALS4: ALU (DS34.1 J1.8), ANDOR4 (K4.3 K4.5), XORXNOR (D10.1 K8.8)
ALU_AND0: ALU (DS1.1), ANDOR4 (K1.7)
ALU_AND1: ALU (DS2.1), ANDOR4 (K2.7)
ALU_AND2: ALU (DS3.1), ANDOR4 (K3.7)
ALU_AND3: ALU (DS4.1), ANDOR4 (K4.7)
ALU_B0: ALU (DS35.1 J1.10), ANDOR4 (D1.1 K1.1), XORXNOR (D7.1 K5.1)
ALU_B1: ALU (DS36.1 J1.12), ANDOR4 (D2.1 K2.1), XORXNOR (D11.1 K7.1)
ALU_B2: ALU (DS37.1 J1.14), ANDOR4 (D3.1 K3.1), XORXNOR (D8.1 K6.1)
ALU_B3: ALU (DS38.1 J1.16), ANDOR4 (D4.1 K4.1), XORXNOR (D12.1 K8.1)
ALU_OR0: ALU (DS5.1), ANDOR4 (K1.2)
ALU_OR1: ALU (DS6.1), ANDOR4 (K2.2)
ALU_OR2: ALU (DS7.1), ANDOR4 (K3.2)
ALU_OR3: ALU (DS8.1), ANDOR4 (K4.2)
ALU_XOR0: ALU (DS13.1), XORXNOR (K5.2)
ALU_XOR1: ALU (DS14.1), XORXNOR (K7.2)
ALU_XOR2: ALU (DS15.1), XORXNOR (K6.2)
ALU_XOR3: ALU (DS16.1), XORXNOR (K8.2)
OP_P2: ALU (DS23.1 J1.9), XORXNOR1 (D14.1 K9.1)